# EasyEDA Pro project Discrete-Buck.eprj

# Schematic DC-DC
Board Name: Board1; Create Date: 2025-11-26; Page Name: P1; Project Name: New Project_2025-11-26_10-26-55; Schematic Name: DC-DC; Update Date: 2025-11-26; Company: 嘉立创EDA; Page Size: A4; Version: V1.0
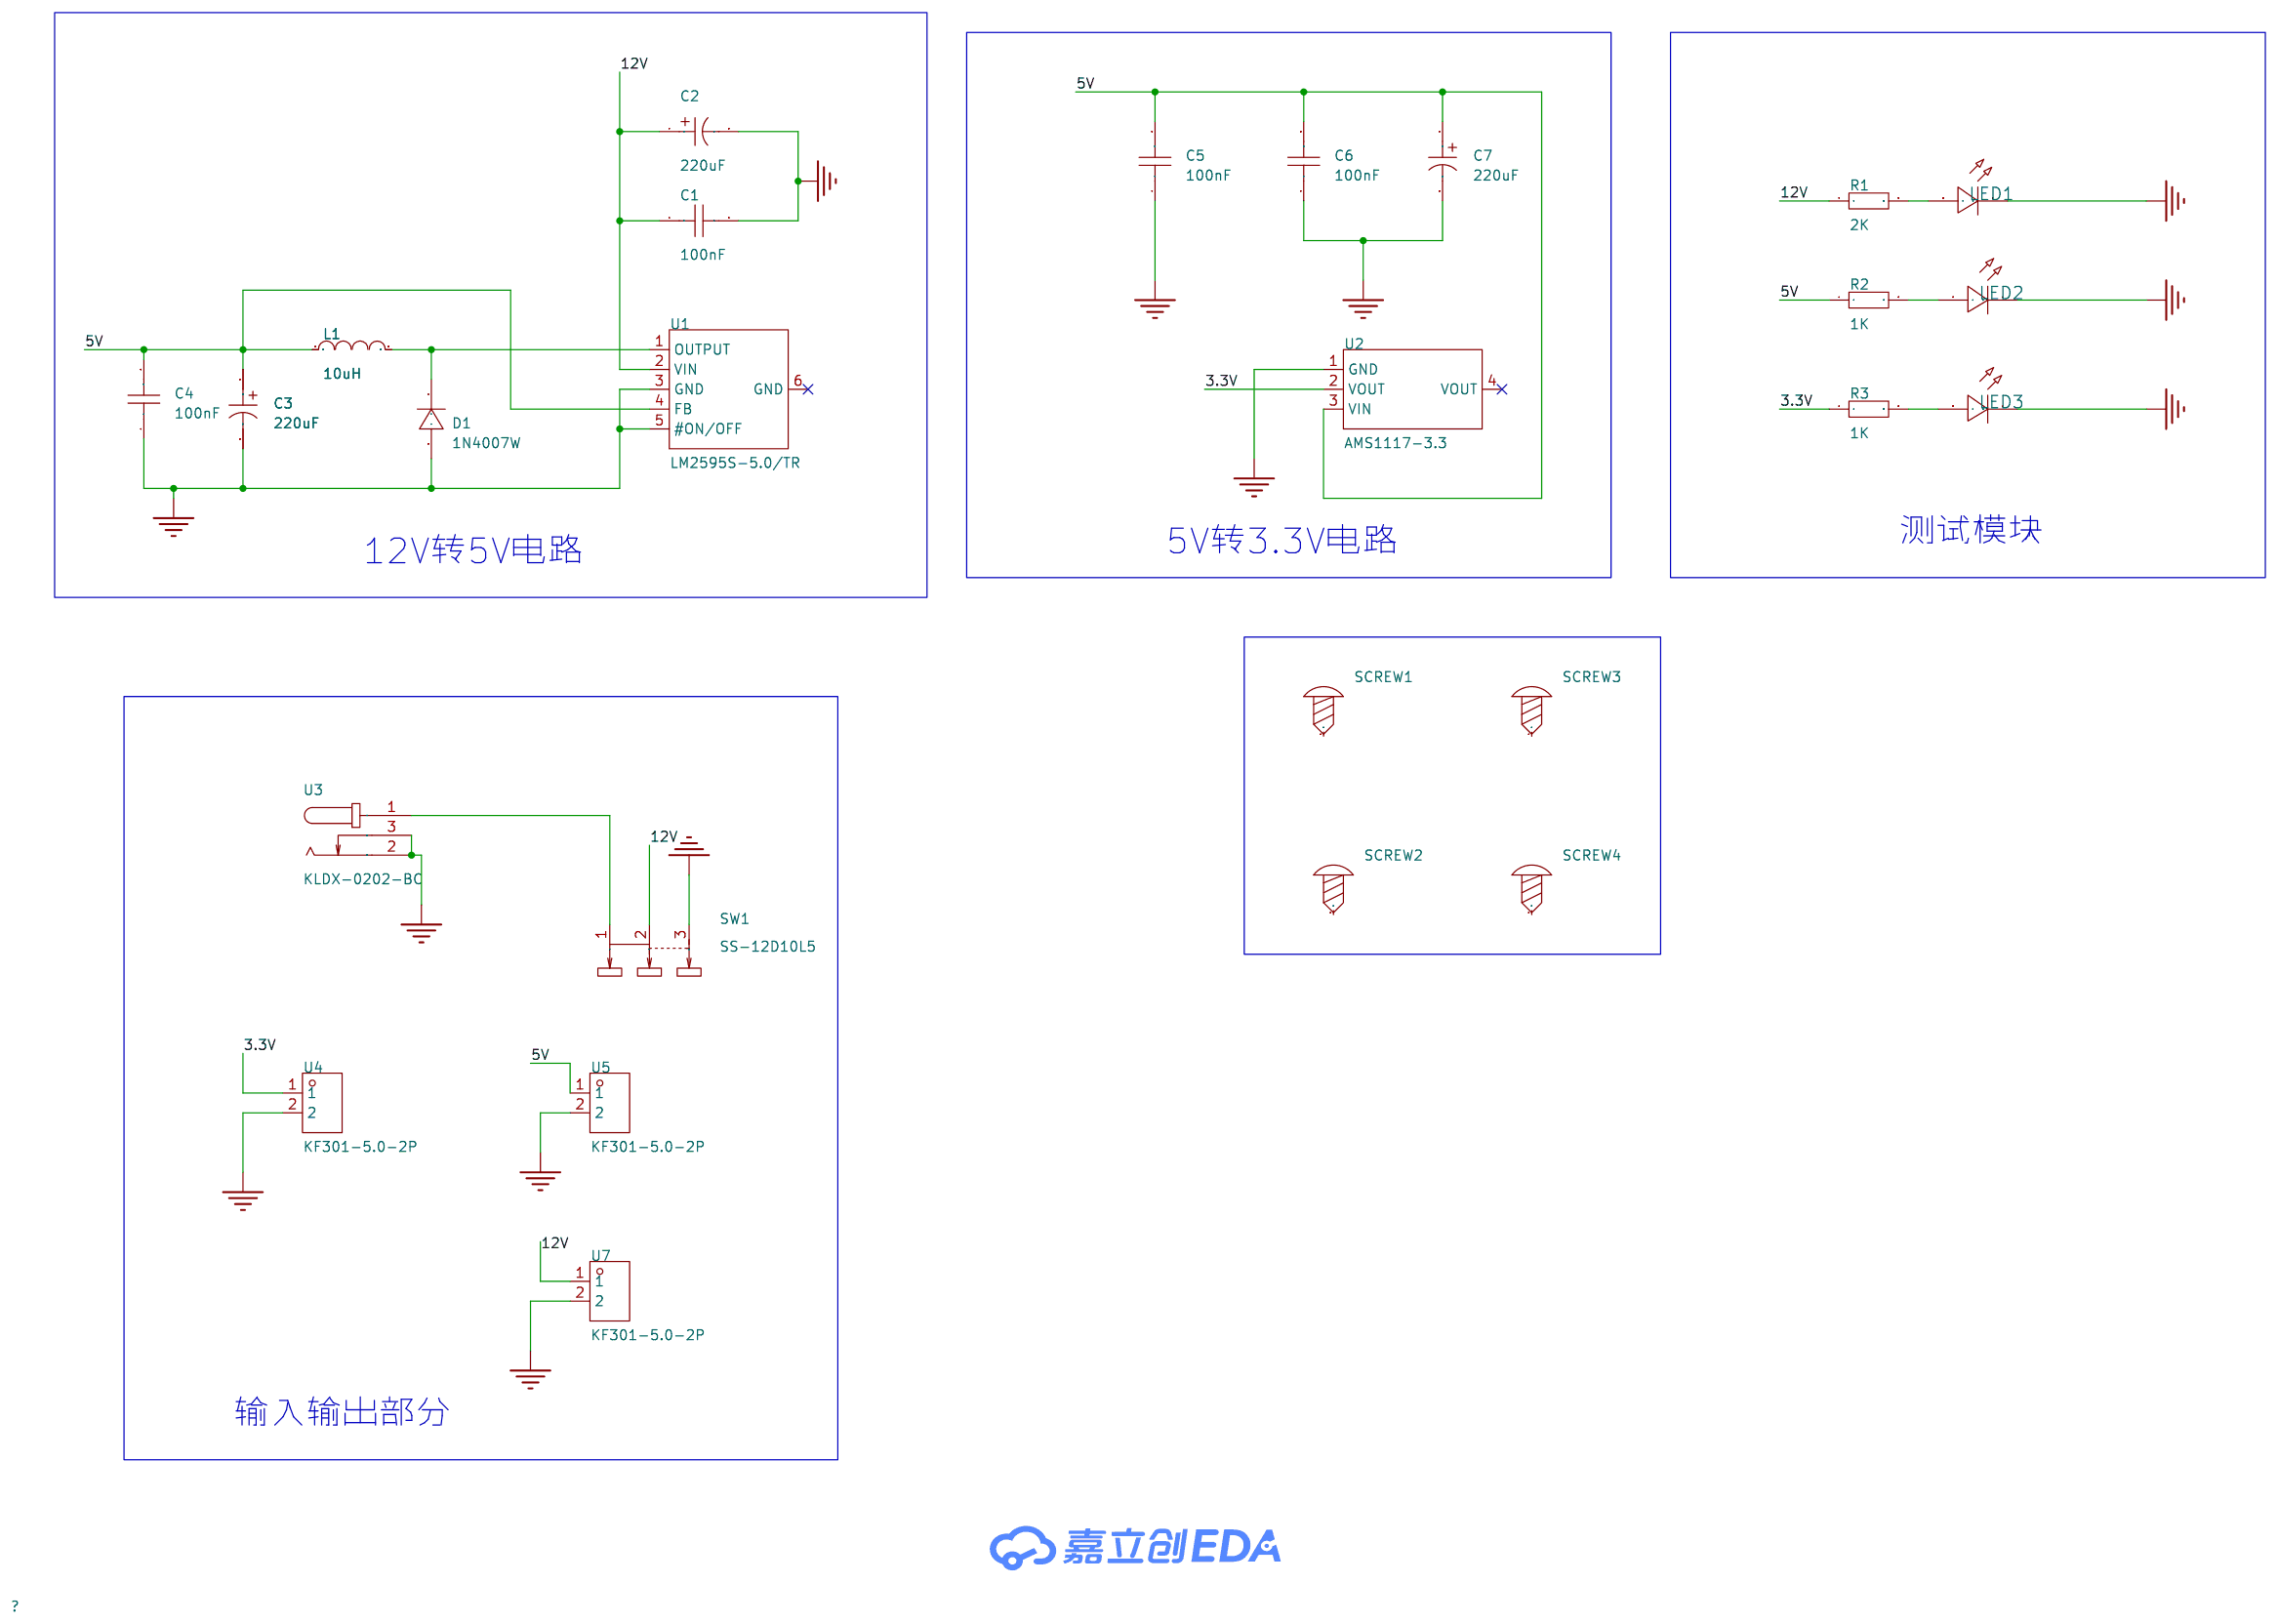
[diagram p0: schematic sheet]

## Parts
C1  100nF  [C0603]
C2  220uF  [CAP-TH_BD6.3-P2.50-D0.5-FD]
C3  220uF  [CAP-TH_BD6.3-P2.50-D0.5-FD]
C4  100nF  [C0603]
C5  100nF  [C0603]
C6  100nF  [C0603]
C7  220uF  [CAP-TH_BD6.3-P2.50-D0.5-FD]
D1  1N4007W  [SOD-123FL_L2.7-W1.8-LS3.8-RD]
L1  10uH  [L0603]
LED1  -  [LED_0603]
LED2  -  [LED_0603]
LED3  -  [LED_0603]
R1  2K  [R0603]
R2  1K  [R0603]
R3  1K  [R0603]
SCREW1  -  [M2螺丝]
SCREW2  -  [M2螺丝]
SCREW3  -  [M2螺丝]
SCREW4  -  [M2螺丝]
SW1  SS-12D10L5  [SW-TH_SS-12D10L5]
U1  LM2595S-5.0/TR  [TO-263-5_L10.6-W9.6-P1.70-LS15.9-BR]
U2  AMS1117-3.3  [SOT-223-3_L6.5-W3.4-P2.30-LS7.0-BR]
U3  KLDX-0202-BC  [DC-IN-TH_KH-DC-005-2.5]
U4  KF301-5.0-2P  [CONN-TH_P5.00_KF301-5.0-2P]
U5  KF301-5.0-2P  [CONN-TH_P5.00_KF301-5.0-2P]
U7  KF301-5.0-2P  [CONN-TH_P5.00_KF301-5.0-2P]

## Library data of the parts
C1 C4-C6 = CAP_0603: Supplier Footprint: 0603
C2 C3 C7 = ERG16V220M6X7: LCSC Part Name: 220uF ±20% 16V; Supplier Part: C47344172; Manufacturer: JIERR(捷而瑞); Supplier Footprint: 插件,D6.3xL7mm; JLCPCB Part Class: 扩展库; Datasheet: https://item.szlcsc.com/datasheet/ERG16V220M6X7/49556613.html; Supplier: LCSC; Tolerance: ±20%; Voltage Rating: 16V; Ripple Current: 300mA@100kHz; Equivalent Series Resistance(ESR): 220mΩ@100kHz; Pin Spacing: 2.5mm; Diameter: 6mm; Height - Seated (Max): 7mm; Lifetime: 2000hrs@105℃; Operating Temperature: -40℃~+105℃
D1 = 1N4007W_C18199088: Supplier Part: C18199088; Manufacturer: R+O(宏嘉诚); Supplier Footprint: SOD-123FL; JLCPCB Part Class: 扩展库; Datasheet: https://item.szlcsc.com/datasheet/1N4007W/19354320.html; Supplier: LCSC; Diode Configuration: 独立式; Voltage - Forward(Vf@If): 1V@1.0A; Voltage - DC Reverse(Vr): 1kV; Current - Rectified: 1A; Reverse Leakage Current (Ir): 2uA@1000V; Non-Repetitive Peak Forward Surge Current: 30A; Operating Junction Temperature Range: -55℃~+150℃
L1 = L_0603
LED1-LED3 = LED_0603-R: Supplier Footprint: 0603
R1-R3 = Res_0603: Supplier Footprint: 0603
SCREW1-SCREW4 = M2螺丝: Supplier Footprint: 插件
SW1 = SS-12D10L5: LCSC Part Name: 柄长5mm 直插双档 滑动开关; Supplier Part: C319012; Manufacturer: XKB Connection(中国星坤); Supplier Footprint: 插件,13x6.8mm; JLCPCB Part Class: 扩展库; Datasheet: https://item.szlcsc.com/datasheet/SS-12D10L5/300104.html; Supplier: LCSC; Circuit: 单刀双掷; Actuator Style: 矩形柱状; Termination Style: PC引脚; Length: 13mm; Width: 6.8mm; Switch Height: 6.4mm; Mounting Type: 直插; Actuator Color: 黑色; Current Rating: 3A; Voltage Rating: 125V; Life: 1万次; Operating Temperature: -40℃~+85℃
U1 = LM2595S-5.0/TR: LCSC Part Name: 3A 150KHZ DC 开关稳压电路; Supplier Part: C316687; Manufacturer: HGSEMI(华冠); Supplier Footprint: TO-263-5; JLCPCB Part Class: 扩展库; Datasheet: https://atta.szlcsc.com/upload/public/pdf/source/20221014/87D65D4B5D0F41C765E63E7BF0BD47C3.pdf; Supplier: LCSC; Function: 降压型; Output Type: 固定; Voltage - Supply: 4.5V~40V; Output Voltage: 5V; Output Current: 3A; Frequency - Switching: 150kHz; Operating Temperature: -40℃~+125℃; Synchronous Rectifier: 否; Number of Outputs: 1; Topology: 降压式; Quiescent Current: 3.6mA; Switch tube (built-in/external): 内置
U2 = AMS1117-3.3_C6186: LCSC Part Name: 输出3.3V 1A; Supplier Part: C6186; Manufacturer: AMS; Supplier Footprint: SOT-223; JLCPCB Part Class: 基础库; Datasheet: https://item.szlcsc.com/datasheet/AMS1117-3.3/6652.html; Supplier: LCSC; Output Type: 固定; Voltage - Supply: 16V; Output Voltage: 3.3V; Output Current: 1A; Power Supply Rejection Ratio (PSRR): 72dB@(120Hz); Voltage Dropout: 1.1V@(800mA); standby current: 5mA; Noise: 0.003%Vout; Features: 过流保护；过热保护; Operating Temperature: -40℃~+125℃; Output Configuration: 正极; Number of Outputs: 1
U3 = KLDX-0202-BC: Supplier Part: C19842599; Manufacturer: Kycon; JLCPCB Part Class: 扩展库; Datasheet: https://atta.szlcsc.com/upload/public/pdf/source/20240122/BBEBA7C20E24BDF046D66E570B7643AA.pdf; Supplier: LCSC
U4 U5 U7 = KF301-5.0-2P: LCSC Part Name: 5mm 1x2P 排数:1 每排P数:2 直插; Supplier Part: C474881; Manufacturer: KEFA(科发); Supplier Footprint: 插件,P=5mm; JLCPCB Part Class: 扩展库; Datasheet: https://atta.szlcsc.com/upload/public/pdf/source/20230317/03A5B5FC229D6F9225E8F51DA1A4E80A.pdf; Supplier: LCSC; Structure: 1x2P; Pitch: 5mm; Color: 蓝色; Mounting Style: 直插; Current Rating (Max): 17A; Voltage Rating (Max): 250V; Number of Pins: 2P; Number of Rows: 1; Wire Gauge - AWG: 14~22; Wire Gauge - mm2: 1.5; Number of PINs Per Row: 2; Operating Temperature Range: -30℃~+120℃

## Nets
3.3V: R3.1 U2.2(VOUT) U4.1
5V: C3.1 C4.2 C5.2 C6.2 C7.1 L1.1 R2.1 U1.4(FB) U2.3(VIN) U5.1
12V: C1.1 C2.1 R1.1 SW1.2 U1.2(VIN) U7.1
GND: C1.2 C2.2 C3.2 C4.1 C5.1 C6.1 C7.2 D1.2(A) LED1.1(C) LED2.1(C) LED3.1(C) SW1.3 U1.3(GND) U1.5(#ON/OFF) U2.1(GND) U3.2 U3.3 U4.2 U5.2 U7.2
$1N842: D1.1(K) L1.2 U1.1(OUTPUT)
$1N1478: SW1.1 U3.1
$1N2184: LED3.2(A) R3.2
$1N2201: LED2.2(A) R2.2
$1N2221: LED1.2(A) R1.2

Not connected (* = marked no-connect by the designer): SCREW1 1; SCREW2 1; SCREW3 1; SCREW4 1; U1 6(GND)*; U2 4(VOUT)*

## Notes on the sheet
- 5V转3.3V电路
- 测试模块
- 12V转5V电路
- 输入输出部分

# Board PCB1
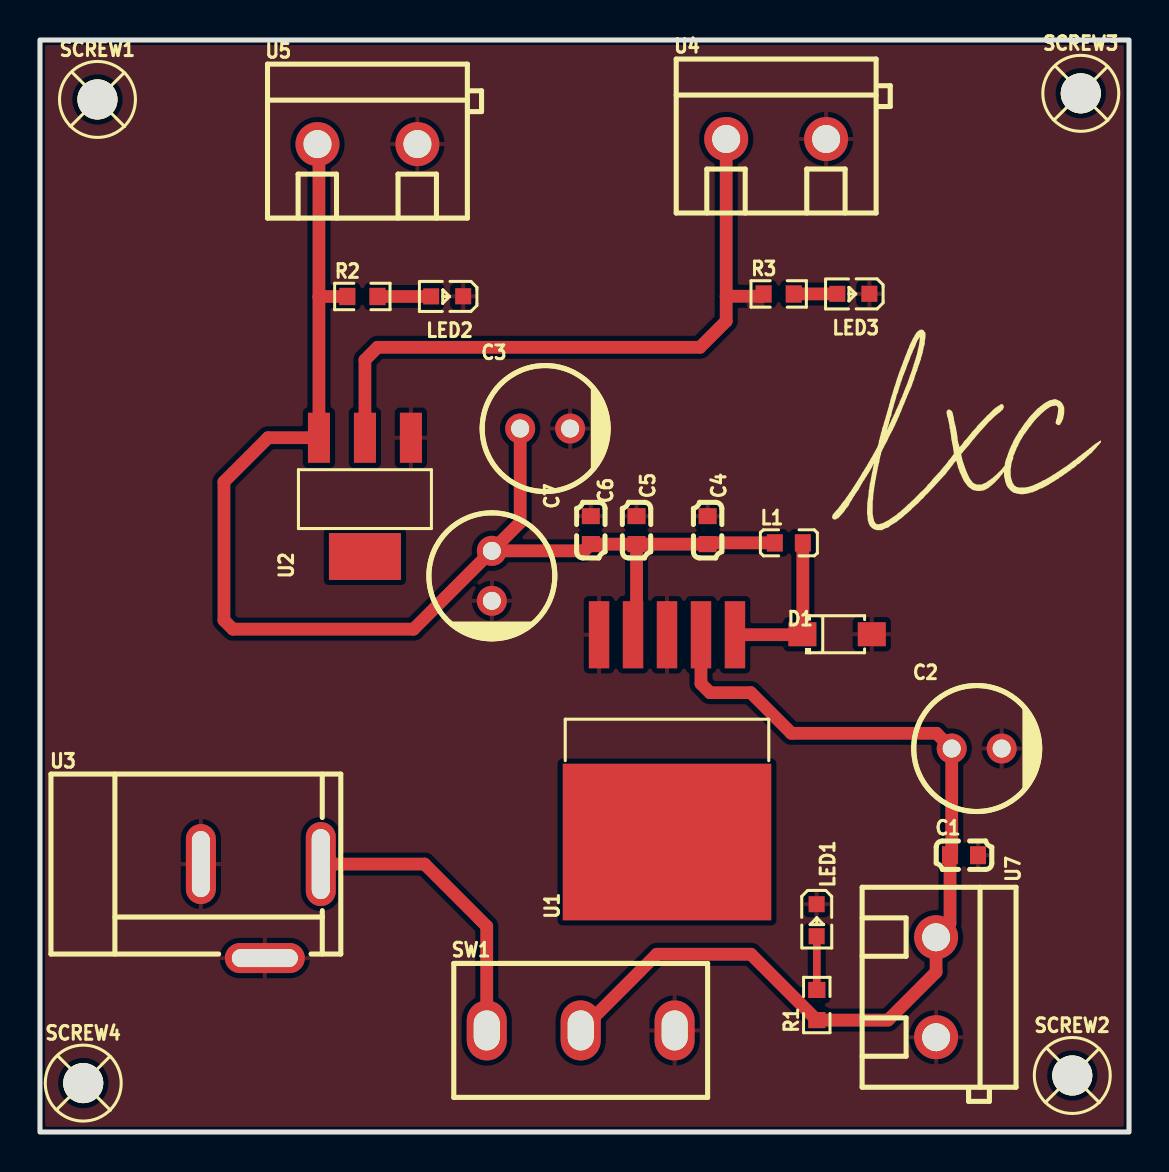
[diagram p1: board, top side]
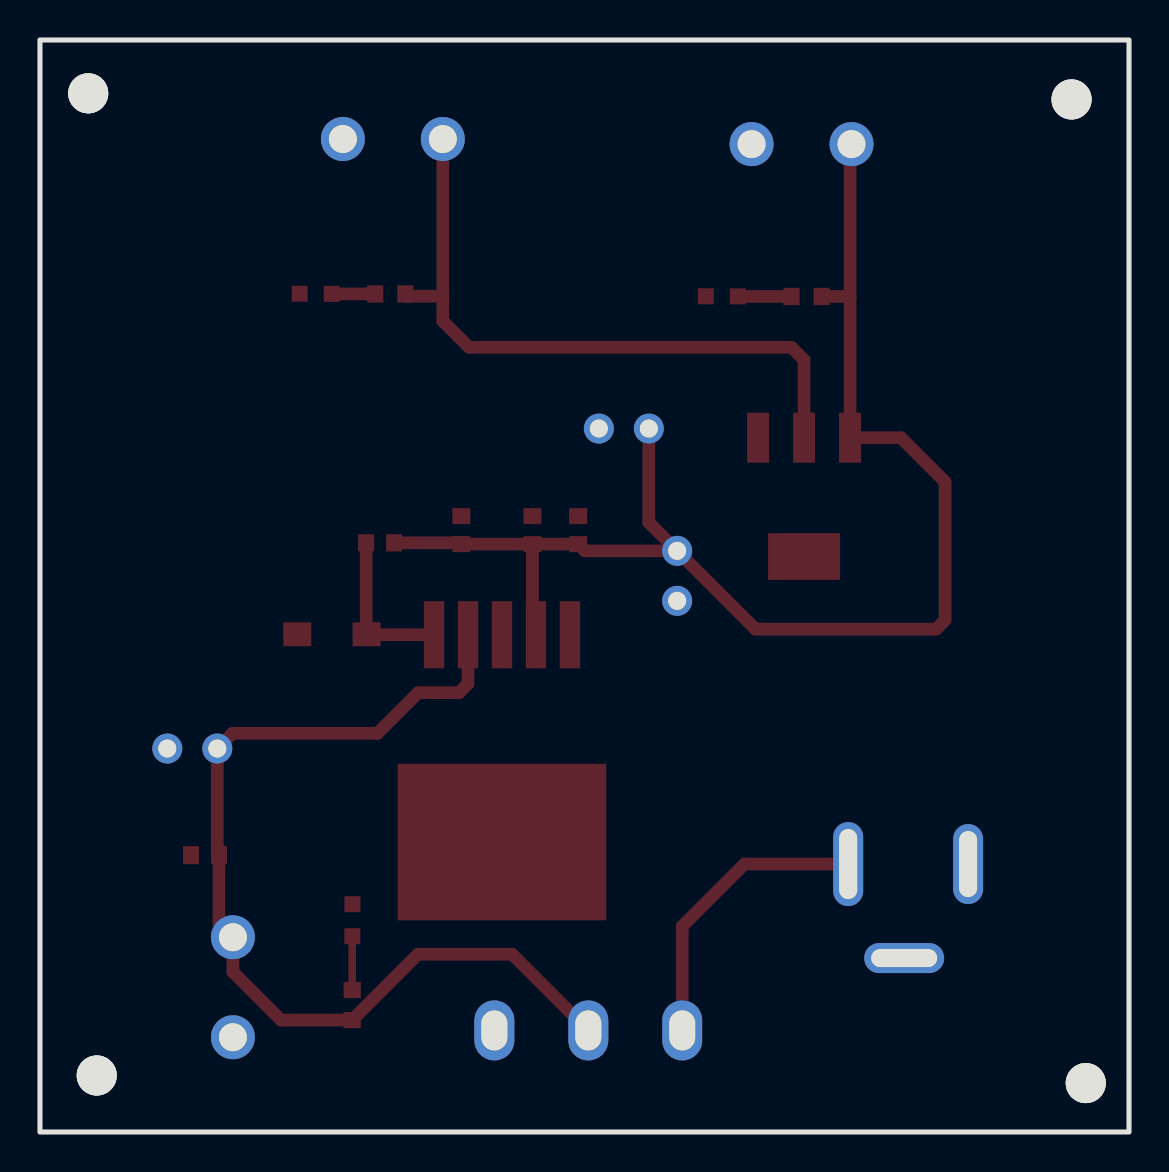
[diagram p2: board, bottom side, seen from below]

Outline 54.48 x 54.61 mm; copper layers: Top Layer, Bottom Layer. Coordinates in mm from the lower left corner of the outline.
Outline path: rectangle 0,54.61 54.48,0
Stack: Top Layer 0.035mm / Dielectric1 1.51mm FR4 er 4.5 / Bottom Layer 0.035mm

## Design rules (mm)
template: JLCPCB Capability(Two Layers Board)
spacing copperThickness1oz (default): track to track 0.102, other pairs 0.152 to 0.3
spacing copperThickness2oz: track to track 0.203, other pairs 0.152 to 0.3
track width copperThickness1oz (default): min 0.127, default 0.254, max 2.54
track width copperThickness2oz: min 0.203, default 0.254, max 2.54
differential pair differentialPair (default): width min 0.127, default 0.254, max 2.54; gap min 0.152, default 0.152
via viaSize (default): diameter min 0.5, default 0.61, max 10; hole min 0.3, default 0.305, max 6.3

## Placement (name value [footprint] x y rotation side)
C1  100nF  [C0603]  46.23 13.84 0 top
C2  220uF  [CAP-TH_BD6.3-P2.50-D0.5-FD]  46.86 19.18 0 top
C3  220uF  [CAP-TH_BD6.3-P2.50-D0.5-FD]  25.27 35.18 0 top
C4  100nF  [C0603]  33.4 30.1 270 top
C5  100nF  [C0603]  29.85 30.1 270 top
C6  100nF  [C0603]  27.56 30.1 270 top
C7  220uF  [CAP-TH_BD6.3-P2.50-D0.5-FD]  22.61 27.81 270 top
D1  1N4007W  [SOD-123FL_L2.7-W1.8-LS3.8-RD]  39.88 24.89 0 top
L1  10uH  [L0603]  37.47 29.46 0 top
LED1  NCD0603Y2  [LED_0603]  38.86 10.54 270 top
LED2  NCD0603Y2  [LED_0603]  20.32 41.78 180 top
LED3  NCD0603Y2  [LED_0603]  40.64 41.91 180 top
R1  2K  [R0603]  38.86 6.35 90 top
R2  1K  [R0603]  16.13 41.78 0 top
R3  1K  [R0603]  36.96 41.91 0 top
SCREW1  -  [M2螺丝]  2.88 51.64 0 top
SCREW2  -  [M2螺丝]  51.64 2.83 0 top
SCREW3  -  [M2螺丝]  52.07 51.94 0 top
SCREW4  -  [M2螺丝]  2.16 2.45 0 top
SW1  SS-12D10L5  [SW-TH_SS-12D10L5]  27.05 5.08 0 top
U1  LM2595S-5.0/TR  [TO-263-5_L10.6-W9.6-P1.70-LS15.9-BR]  31.37 19.69 90 top
U2  AMS1117-3.3  [SOT-223-3_L6.5-W3.4-P2.30-LS7.0-BR]  16.26 31.75 90 top
U3  KLDX-0202-BC  [DC-IN-TH_KH-DC-005-2.5]  11.05 11.05 0 top
U4  KF301-5.0-2P  [CONN-TH_P5.00_KF301-5.0-2P]  36.83 49.66 0 top
U5  KF301-5.0-2P  [CONN-TH_P5.00_KF301-5.0-2P]  16.38 49.4 0 top
U7  KF301-5.0-2P  [CONN-TH_P5.00_KF301-5.0-2P]  44.83 7.24 270 top

## Footprints (pads in the part's own frame, mm; a bottom-side part is the same pattern mirrored in y, then rotated)
C0603
  rect 0.8x0.9 smd: 1(-0.7,0) 2(0.7,0)
CAP-TH_BD6.3-P2.50-D0.5-FD
  round 1.5 hole 0.9: 1(-1.25,0) 2(1.25,0)
CONN-TH_P5.00_KF301-5.0-2P
  round 2.2 hole 1.4: 1(-2.5,0) 2(2.5,0)
DC-IN-TH_KH-DC-005-2.5
  oval 1.5x4.2 hole 0.9x3.5: 1(3,2.35)
  oval 1.5x4 hole 0.9x3.3: 2(-3,2.35)
  oval 4x1.5 hole 3.3x0.9: 3(0.2,-2.35)
L0603
  rect 0.8x0.864 smd: 1(-0.7,0) 2(0.7,0)
LED_0603
  rect 0.8x0.8 smd: 1(-0.851,-0.01) 2(0.75,-0.005)
M2螺丝
  round 2 hole 2: 1(0,0)
R0603
  rect 0.806x0.864 smd: 1(-0.753,0) 2(0.753,0)
SOD-123FL_L2.7-W1.8-LS3.8-RD
  rect 1.4x1.2 smd: 1(-1.735,0) 2(1.735,0)
SOT-223-3_L6.5-W3.4-P2.30-LS7.0-BR
  rect 2.5x1.1 smd: 1(2.97,-2.3) 2(2.97,0) 3(2.97,2.3)
  rect 2.34x3.6 smd: 4(-2.97,0)
SW-TH_SS-12D10L5
  oval 2x3 hole 1.3x2: 1(-4.7,0) 2(0,0) 3(4.7,0)
TO-263-5_L10.6-W9.6-P1.70-LS15.9-BR
  rect 3.358x1.02 smd: 1(5.184,-3.4) 2(5.184,-1.7) 3(5.184,0) 4(5.184,1.7) 5(5.184,3.4)
  rect 7.83x10.431 smd: 6(-5.184,0)

## Nets
As in the schematic.

Pads without a net: SCREW1 1; SCREW2 1; SCREW3 1; SCREW4 1; U1 6; U2 4

## Routing (per net, layer and track width the routed paths; a pad name or vN(x,y) marks a point on that pad's centre or on a via; arc(x,y) is an arc through that point)
3.3V: length 33.8
  Top Layer w0.635: 34.33,41.8 34.33,40.55 33.02,39.24 16.89,39.24 16.26,38.61 U2.2 ; 34.33,41.8 U4.1 ; 34.33,41.8 36.09,41.8 R3.1
5V: length 69.7
  Top Layer w0.635: 13.96,41.75 U2.3 11.41,34.72 9.2,32.51 9.2,25.6 9.65,25.15 18.69,25.15 C7.1 ; 13.96,41.75 13.99,41.78 R2.1 ; 13.96,41.75 13.96,49.1 14.26,49.4 ; C7.1 27.22,29.06 C6.2 C5.2 ; C7.1 24.02,30.48 C3.1 ; C5.2 C4.2 33.47,29.46 L1.1 ; C5.2 29.85,25.04 U1.4
12V: length 49.6
  Top Layer w0.635: SW1.2 30.86,8.89 35.57,8.89 R1.1 42.43,5.6 44.83,8 U7.1 45.53,10.44 C1.1 45.61,13.93 C2.1 44.85,19.94 37.59,19.94 35.56,21.97 33.52,21.97 33.07,22.42 U1.2
$1N842: length 8
  Top Layer w0.635: L1.2 38.17,24.91 D1.1 38.12,24.87 U1.1
$1N1478: length 14.8
  Top Layer w0.635: SW1.1 22.35,10.29 19.24,13.4 U3.1
$1N2184: length 2.2
  Top Layer w0.635: LED3.2 39.89,41.91 R3.2
$1N2201: length 2.7
  Top Layer w0.635: LED2.2 19.57,41.78 R2.2
$1N2221: length 2.7
  Top Layer w0.381: R1.2 38.86,9.79 LED1.2

## Copper pours and planes (outline as drawn; the poured copper is in the pictures)
GND on Top Layer: -2.67,57.53 58.42,57.53 58.42,-2.41 -2.67,-2.41
